# EAGLE schematic mainboard_2l (EAGLE 9.5.1)
c't-Bot Hauptplatine v2; CC BY-SA 4.0, Timo Sandmann

## Sheet 1 of 2
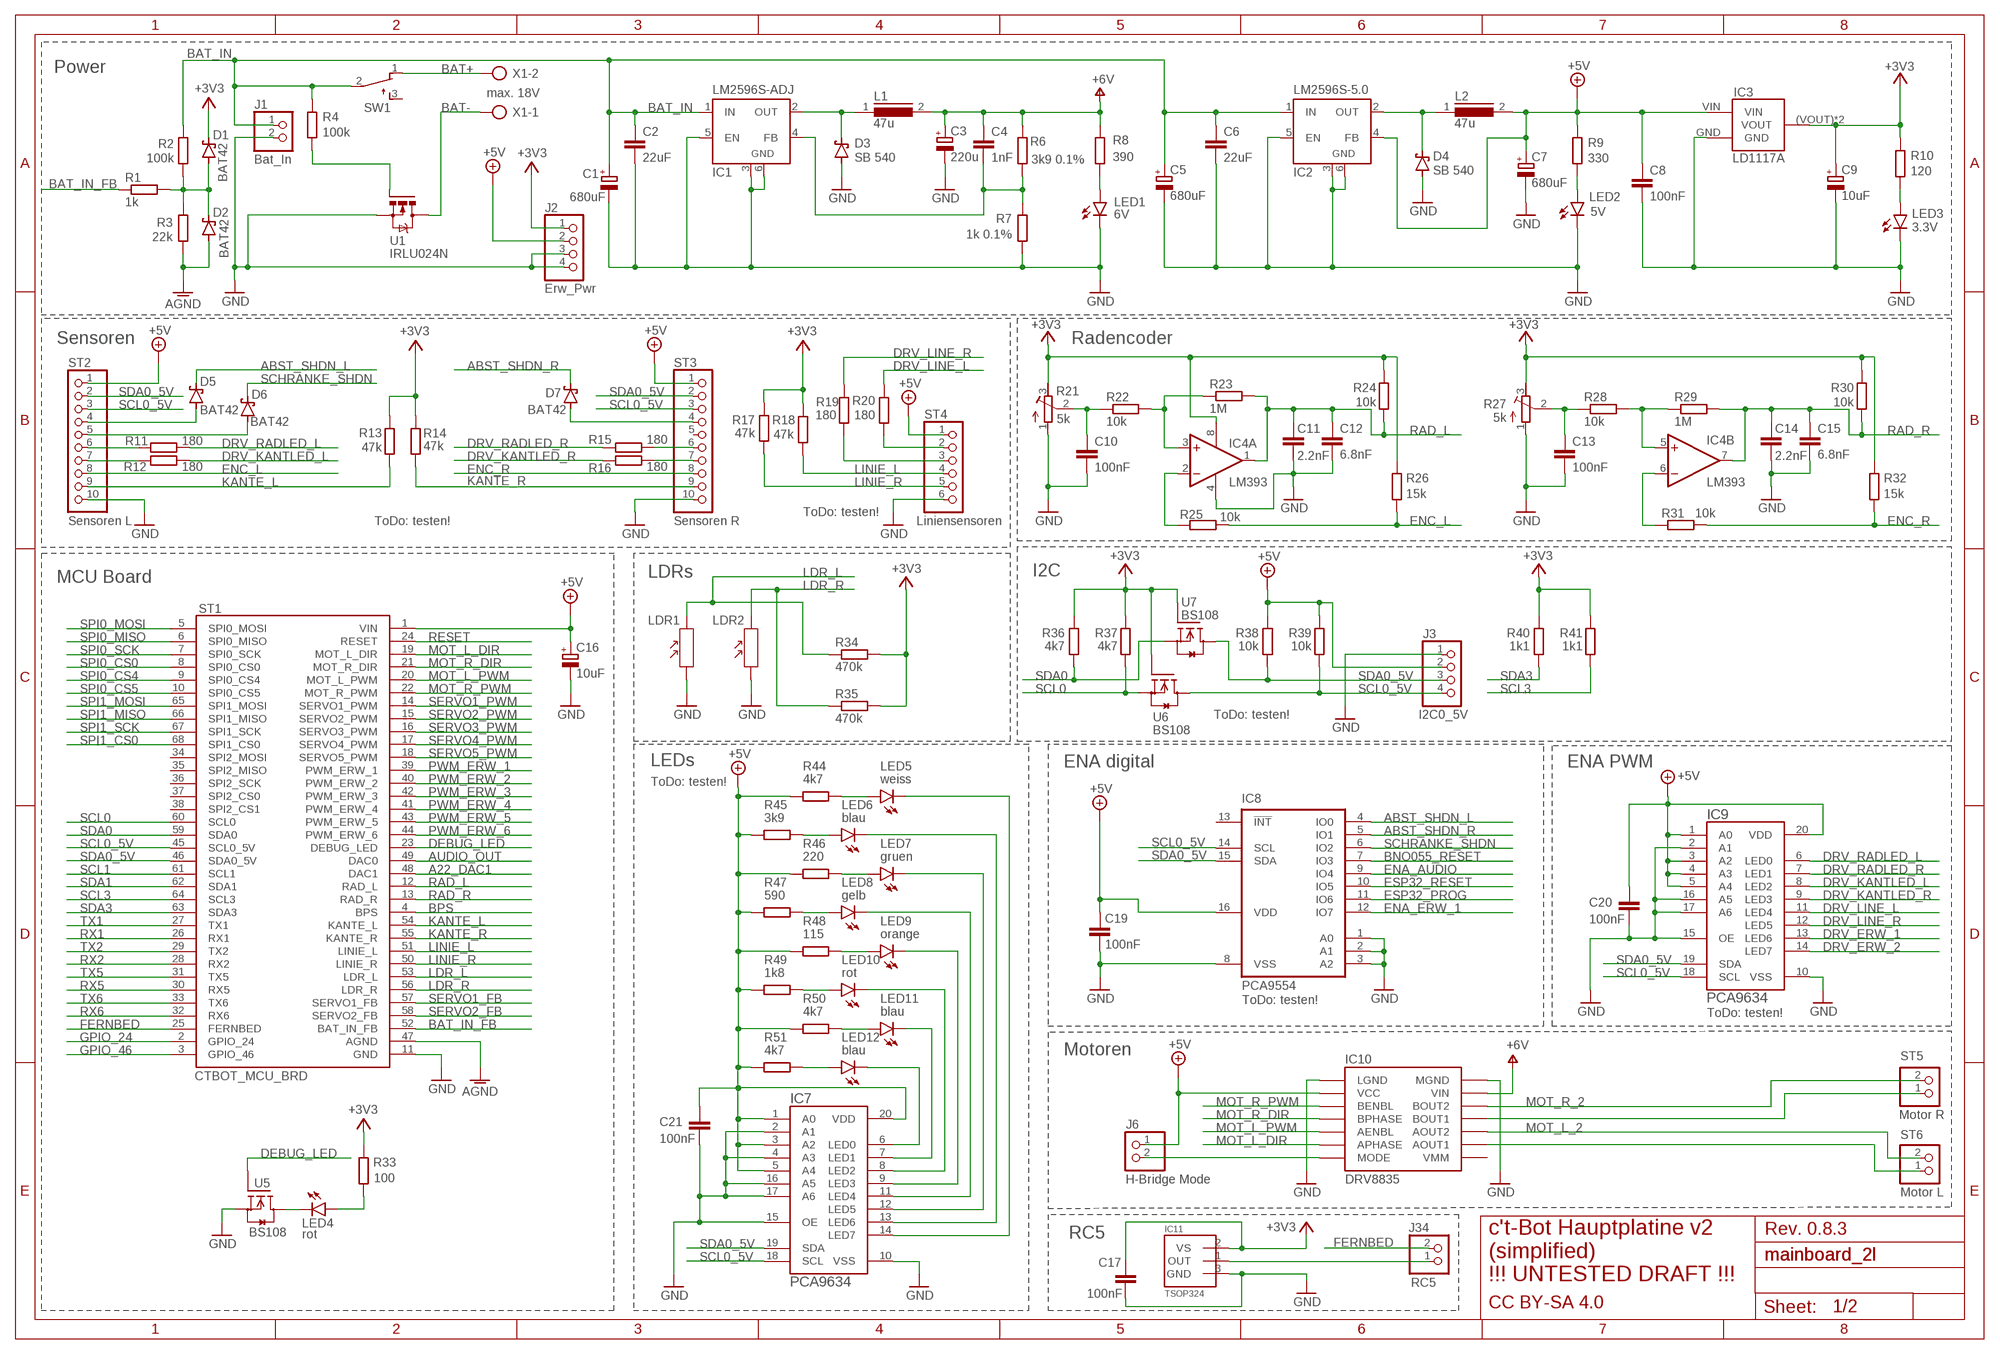
[diagram p0: schematic, sheet 1]

### Parts
C1  680uF  CPOL-EUE5-10.5  [E5-10,5]
C2  22uF  C-EU025-025X050  [C025-025X050]
C3  220u  CPOL-EUE5-10.5  [E5-10,5]
C4  1nF  C-EU025-025X050  [C025-025X050]
C5  680uF  CPOL-EUE5-10.5  [E5-10,5]
C6  22uF  C-EU025-025X050  [C025-025X050]
C7  680uF  CPOL-EUE5-10.5  [E5-10,5]
C8  100nF  C-EU025-025X050  [C025-025X050]
C9  10uF  CPOL-EUE2-5  [E2-5]
C10  100nF  C-EU025-025X050  [C025-025X050]
C11  2.2nF  C-EU025-025X050  [C025-025X050]
C12  6.8nF  C-EU025-025X050  [C025-025X050]
C13  100nF  C-EU025-025X050  [C025-025X050]
C14  2.2nF  C-EU025-025X050  [C025-025X050]
C15  6.8nF  C-EU025-025X050  [C025-025X050]
C16  10uF  CPOL-EUTT2D5L  [TT2D5L]
C17  100nF  C-EU025-025X050  [C025-025X050]
C19  100nF  C-EU025-025X050  [C025-025X050]
C20  100nF  C-EU025-025X050  [C025-025X050]
C21  100nF  C-EU025-025X050  [C025-025X050]
D1  BAT42  BAT42DO35-7  [DO35-7]
D2  BAT42  BAT42DO35-7  [DO35-7]
D3  SB 540  SCHOTTKY-DIODEDO201T15  [DO201T15]
D4  SB 540  SCHOTTKY-DIODEDO201T15  [DO201T15]
D5  BAT42  BAT42"  [0207/2V]
D6  BAT42  BAT42"  [0207/2V]
D7  BAT42  BAT42"  [0207/2V]
IC1  LM2596S-ADJ  LM2596S  [TO263-5]
IC2  LM2596S-5.0  LM2596S  [TO263-5]
IC3  LD1117A  LD1117  [LD1117SOT-223]
IC4  LM393  LM393N  [DIL08]
IC7  PCA9634  PCA9634-SO20  [SO20W]
IC8  PCA9554  PCA9554D  [SO16W]
IC9  PCA9634  PCA9634-SO20  [SO20W]
IC10  DRV8835  DRV8835THROUGHHOLE  [DRV8835]
IC11  TSOP324  [TSOP324]
J1  Bat_In  PINHD-1X2  [1X02]
J2  Erw_Pwr  PINHD-1X4  [1X04]
J3  I2C0_5V  PINHD-1X4  [1X04]
J6  H-Bridge Mode  PINHD-1X2  [1X02]
J34  RC5  PINHD-1X2  [1X02]
L1  47u  INDUCTOR_09HCP  [09HCP]
L2  47u  INDUCTOR_09HCP  [09HCP]
LDR1  MPY54C569  [SNR2-3.0]
LDR2  MPY54C569  [SNR2-3.0]
LED1  6V  LED3MM  [LED3MM]
LED2  5V  LED3MM  [LED3MM]
LED3  3.3V  LED3MM  [LED3MM]
LED4  rot  LED3MM  [LED3MM]
LED5  weiss  LED3MM  [LED3MM]
LED6  blau  LED3MM  [LED3MM]
LED7  gruen  LED3MM  [LED3MM]
LED8  gelb  LED3MM  [LED3MM]
LED9  orange  LED3MM  [LED3MM]
LED10  rot  LED3MM  [LED3MM]
LED11  blau  LED3MM  [LED3MM]
LED12  blau  LED3MM  [LED3MM]
R1  1k  R-EU_0204/7  [0204/7]
R2  100k  R-EU_0204/2V  [0204V]
R3  22k  R-EU_0204/7  [0204/7]
R4  100k  R-EU_0204/2V  [0204V]
R6  3k9 0.1%  R-EU_0204/2V  [0204V]
R7  1k 0.1%  R-EU_0204/2V  [0204V]
R8  390  R-EU_0204/2V  [0204V]
R9  330  R-EU_0204/2V  [0204V]
R10  120  R-EU_0204/2V  [0204V]
R11  180  R-EU_0204/2V  [0204V]
R12  180  R-EU_0204/2V  [0204V]
R13  47k  R-EU_0204/2V  [0204V]
R14  47k  R-EU_0204/2V  [0204V]
R15  180  R-EU_0204/2V  [0204V]
R16  180  R-EU_0204/2V  [0204V]
R17  47k  R-EU_0204/2V  [0204V]
R18  47k  R-EU_0204/2V  [0204V]
R19  180  R-EU_0204/2V  [0204V]
R20  180  R-EU_0204/2V  [0204V]
R21  5k  R-TRIMM64W  [RTRIM64W]
R22  10k  R-EU_0204/2V  [0204V]
R23  1M  R-EU_0204/2V  [0204V]
R24  10k  R-EU_0204/2V  [0204V]
R25  10k  R-EU_0204/2V  [0204V]
R26  15k  R-EU_0204/2V  [0204V]
R27  5k  R-TRIMM64W  [RTRIM64W]
R28  10k  R-EU_0204/7  [0204/7]
R29  1M  R-EU_0204/7  [0204/7]
R30  10k  R-EU_0204/7  [0204/7]
R31  10k  R-EU_0204/2V  [0204V]
R32  15k  R-EU_0204/2V  [0204V]
R33  100  R-EU_0204/2V  [0204V]
R34  470k  R-EU_0204/2V  [0204V]
R35  470k  R-EU_0204/2V  [0204V]
R36  4k7  R-EU_0204/2V  [0204V]
R37  4k7  R-EU_0204/2V  [0204V]
R38  10k  R-EU_0204/2V  [0204V]
R39  10k  R-EU_0204/2V  [0204V]
R40  1k1  R-EU_0204/2V  [0204V]
R41  1k1  R-EU_0204/2V  [0204V]
R44  4k7  R-EU_0204/2V  [0204V]
R45  3k9  R-EU_0204/2V  [0204V]
R46  220  R-EU_0204/2V  [0204V]
R47  590  R-EU_0204/2V  [0204V]
R48  115  R-EU_0204/2V  [0204V]
R49  1k8  R-EU_0204/2V  [0204V]
R50  4k7  R-EU_0204/2V  [0204V]
R51  4k7  R-EU_0204/2V  [0204V]
ST1  CTBOT_MCU_BRD  [DIP66]
ST2  Sensoren L  PS25-10PS25-10  [TS_PS25_10]
ST3  Sensoren R  PS25-10PS25-10  [TS_PS25_10]
ST4  Liniensensoren  PS25-6  [TS_PS25_6]
ST5  Motor R  PINHD90-1X2/90  [1X02/90]
ST6  Motor L  PINHD90-1X2/90  [1X02/90]
SW1  TL32PO  [TL3XPO]
U1  IRLU024N  IRLU024NTO-251AA  [TO251AA]
U5  BS108  [SOT54E]
U6  BS108  [SOT54E]
U7  BS108  [SOT54E]
X1  max. 18V  SCHRAUBKLEMME/2  [AK500/2-H]

### Nets
+3V3 [power]: C9.+ C17.1 D1.C IC3.(VOUT)(VOUT) IC3.VOUT IC4.8(P:V+) IC11.2(VS) J2.1 R10.2 R13.2 R14.1 R17.2 R18.2 R21.3(E) R24.2 R26.2 R27.3(E) R30.2 R32.2 R33.2 R34.2 R35.2 R36.2 R37.2 R40.2 R41.2 U6.G U7.G ; also sheet 2
+6V [high_current]: C3.+ C4.1 IC10.VIN L1.2 R6.2 R8.1 ; also sheet 2
A22_DAC1: ST1.48(DAC1) ; also sheet 2
ABST_SHDN_L: D5.2(C) IC8.4(IO0)
ABST_SHDN_R: D7.2(C) IC8.5(IO1)
AGND [power]: D2.A R3.1 ST1.47(AGND) ; also sheet 2
AUDIO_OUT: ST1.49(DAC0) ; also sheet 2
BAT+ [high_current]: SW1.1(O) X1.2
BAT- [high_current]: U1.2(D) U1.4(D) X1.1
BAT_IN [high_current]: C1.+ C2.1 C5.+ C6.1 IC1.1(IN) IC2.1(IN) J1.1 R2.2 R4.2 SW1.2(P)
BAT_IN_FB: R1.1 ST1.52(BAT_IN_FB)
BNO055_RESET: IC8.7(IO3) ; also sheet 2
BPS: ST1.4(BPS) ; also sheet 2
DEBUG_LED: ST1.23(DEBUG_LED) U5.G
DRV_ERW_1: IC9.13(LED6) ; also sheet 2
DRV_ERW_2: IC9.14(LED7) ; also sheet 2
DRV_KANTLED_L: IC9.8(LED2) R12.2
DRV_KANTLED_R: IC9.9(LED3) R16.1
DRV_LINE_L: IC9.11(LED4) R20.2
DRV_LINE_R: IC9.12(LED5) R19.2
DRV_RADLED_L: IC9.6(LED0) R11.2
DRV_RADLED_R: IC9.7(LED1) R15.1
ENA_AUDIO: IC8.9(IO4) ; also sheet 2
ENA_ERW_1: IC8.12(IO7) ; also sheet 2
ENC_L: R25.2 R26.1 ST2.8
ENC_R: R31.2 R32.1 ST3.8
ESP32_PROG: IC8.11(IO6) ; also sheet 2
ESP32_RESET: IC8.10(IO5) ; also sheet 2
FERNBED: J34.2 ST1.25(FERNBED)
GND [power]: C1.- C2.2 C3.- C5.- C6.2 C7.- C8.2 C9.- C10.2 C11.2 C12.2 C13.2 C14.2 C15.2 C16.- C17.2 C19.2 C20.2 C21.2 D3.A D4.A IC1.3(GND) IC1.5(EN) IC1.6(GND) IC2.3(GND) IC2.5(EN) IC2.6(GND) IC3.GND IC4.4(P:V-) IC7.2(A1) IC7.4(A3) IC7.10(VSS) IC7.15(OE) IC7.16(A5) IC7.17(A6) IC8.1(A0) IC8.2(A1) IC8.3(A2) IC8.8(VSS) IC9.2(A1) IC9.10(VSS) IC9.15(OE) IC9.16(A5) IC9.17(A6) IC10.LGND IC10.MGND IC11.3(GND) J1.2 J2.3 J2.4 J3.1 LDR1.1 LDR2.1 LED1.K(C) LED2.K(C) LED3.K(C) R7.1 R21.1(A) R27.1(A) ST1.11(GND) ST2.10 ST3.10 ST4.6 U1.3(S) U5.S ; also sheet 2
GPIO_24: ST1.2(GPIO_24) ; also sheet 2
GPIO_46: ST1.3(GPIO_46) ; also sheet 2
KANTE_L: R13.1 ST1.54(KANTE_L) ST2.9
KANTE_R: R14.2 ST1.55(KANTE_R) ST3.9
LDR_L: LDR1.2 R34.1 ST1.53(LDR_L)
LDR_R: LDR2.2 R35.1 ST1.56(LDR_R)
LINIE_L: R18.1 ST1.51(LINIE_L) ST4.4
LINIE_R: R17.1 ST1.50(LINIE_R) ST4.5
MOT_L_1 [high_current]: IC10.AOUT1 ST6.1
MOT_L_2: IC10.AOUT2 ST6.2
MOT_L_DIR: IC10.APHASE ST1.19(MOT_L_DIR)
MOT_L_PWM: IC10.AENBL ST1.20(MOT_L_PWM)
MOT_R_1 [high_current]: IC10.BOUT1 ST5.1
MOT_R_2: IC10.BOUT2 ST5.2
MOT_R_DIR: IC10.BPHASE ST1.21(MOT_R_DIR)
MOT_R_PWM: IC10.BENBL ST1.22(MOT_R_PWM)
N$1: R19.1 ST4.3
N$2: LED3.A R10.1
N$3: IC10.MODE J6.2
N$4: D1.A D2.C R1.2 R2.1 R3.2
N$5: IC4.2(A:-IN) R25.1
N$6: IC7.6(LED0) LED12.K(C)
N$7: IC7.7(LED1) LED11.K(C)
N$8 [power]: LED1.A R8.2
N$9: C4.2 IC1.4(FB) R6.1 R7.2
N$10: IC4.6(B:-IN) R31.1
N$11: LED2.A R9.1
N$13: IC7.8(LED2) LED10.K(C)
N$15: IC7.9(LED3) LED9.K(C)
N$16: IC7.11(LED4) LED8.K(C)
N$17: IC7.12(LED5) LED7.K(C)
N$18: IC7.13(LED6) LED6.K(C)
N$19: IC7.14(LED7) LED5.K(C)
N$20: LED5.A R44.2
N$21: LED6.A R45.2
N$22: LED7.A R46.2
N$23: LED8.A R47.2
N$24: LED9.A R48.2
N$25: LED10.A R49.2
N$26: LED11.A R50.2
N$27: LED12.A R51.2
N$28: LED4.A R33.1
N$29: LED4.K(C) U5.D
N$30: R20.1 ST4.2
N$34: C10.1 R21.2(S) R22.1
N$35: IC4.3(A:+IN) R22.2 R23.1
N$36: C13.1 R27.2(S) R28.1
N$37: IC4.5(B:+IN) R28.2 R29.1
N$38: R4.1 U1.1(G)
N$45: R15.2 ST3.6
N$47: R11.1 ST2.6
N$51: R12.1 ST2.7
N$53: R16.2 ST3.7
PWM_ERW_1: ST1.39(PWM_ERW_1)
PWM_ERW_2: ST1.40(PWM_ERW_2)
PWM_ERW_3: ST1.42(PWM_ERW_3) ; also sheet 2
PWM_ERW_4: ST1.41(PWM_ERW_4)
PWM_ERW_5: ST1.43(PWM_ERW_5)
PWM_ERW_6: ST1.44(PWM_ERW_6)
RAD_L: C11.1 C12.1 IC4.1(A:OUT) R23.2 R24.1 ST1.12(RAD_L)
RAD_R: C14.1 C15.1 IC4.7(B:OUT) R29.2 R30.1 ST1.13(RAD_R)
RC5: IC11.1(OUT) J34.1
RESET: ST1.24(RESET) ; also sheet 2
RX1: ST1.26(RX1) ; also sheet 2
RX2: ST1.28(RX2)
RX5: ST1.30(RX5) ; also sheet 2
RX6: ST1.32(RX6) ; also sheet 2
SCHRANKE_SHDN: D6.2(C) IC8.6(IO2)
SCL0: R37.1 ST1.60(SCL0) U6.S ; also sheet 2
SCL0_5V: IC7.18(SCL) IC8.14(SCL) IC9.18(SCL) J3.4 R39.1 ST1.45(SCL0_5V) ST2.3 ST3.3 U6.D ; also sheet 2
SCL1: ST1.61(SCL1)
SCL3: R41.1 ST1.64(SCL3) ; also sheet 2
SDA0: R36.1 ST1.59(SDA0) U7.S ; also sheet 2
SDA0_5V: IC7.19(SDA) IC8.15(SDA) IC9.19(SDA) J3.3 R38.1 ST1.46(SDA0_5V) ST2.2 ST3.2 U7.D ; also sheet 2
SDA1: ST1.62(SDA1)
SDA3: R40.1 ST1.63(SDA3) ; also sheet 2
SERVO1_FB: ST1.57(SERVO1_FB) ; also sheet 2
SERVO1_PWM: ST1.14(SERVO1_PWM) ; also sheet 2
SERVO2_FB: ST1.58(SERVO2_FB)
SERVO2_PWM: ST1.15(SERVO2_PWM)
SERVO3_PWM: ST1.16(SERVO3_PWM)
SERVO4_PWM: ST1.17(SERVO4_PWM) ; also sheet 2
SERVO5_PWM: ST1.18(SERVO5_PWM) ; also sheet 2
SPI0_CS0: ST1.8(SPI0_CS0) ; also sheet 2
SPI0_CS4: ST1.9(SPI0_CS4) ; also sheet 2
SPI0_CS5: ST1.10(SPI0_CS5) ; also sheet 2
SPI0_MISO: ST1.6(SPI0_MISO) ; also sheet 2
SPI0_MOSI: ST1.5(SPI0_MOSI) ; also sheet 2
SPI0_SCK: ST1.7(SPI0_SCK) ; also sheet 2
SPI1_CS0: ST1.68(SPI1_CS0) ; also sheet 2
SPI1_MISO: ST1.66(SPI1_MISO) ; also sheet 2
SPI1_MOSI: ST1.65(SPI1_MOSI) ; also sheet 2
SPI1_SCK: ST1.67(SPI1_SCK) ; also sheet 2
TX1: ST1.27(TX1) ; also sheet 2
TX2: ST1.29(TX2)
TX5: ST1.31(TX5) ; also sheet 2
TX6: ST1.33(TX6) ; also sheet 2
V5_L1 [high_current]: D4.C IC2.2(OUT) L2.1
V6_L1 [high_current]: D3.C IC1.2(OUT) L1.1
VCC [power]: C7.+ C8.1 C16.+ C19.1 C20.1 C21.1 IC2.4(FB) IC3.VIN IC7.1(A0) IC7.3(A2) IC7.5(A4) IC7.20(VDD) IC8.16(VDD) IC9.1(A0) IC9.3(A2) IC9.4(A3) IC9.5(A4) IC9.20(VDD) IC10.VCC J2.2 J3.2 J6.1 L2.2 R9.2 R38.2 R39.2 R44.1 R45.1 R46.1 R47.1 R48.1 R49.1 R50.1 R51.1 ST1.1(VIN) ST2.1 ST3.1 ST4.1 ; supply symbol labelled +5V ; also sheet 2
VL53L0X_SHUT_L: D5.1(A) ST2.4
VL53L0X_SHUT_R: D7.1(A) ST3.4
VL6180X_SHDN: D6.1(A) ST2.5
Unconnected: IC8.13(!INT) IC10.VMM ST1.34(SPI2_MOSI) ST1.35(SPI2_MISO) ST1.36(SPI2_SCK) ST1.37(SPI2_CS0) ST1.38(SPI2_CS1) ST3.5 SW1.3(S)

### Notes on the sheet
- Power
- Sensoren | Radencoder
- ToDo: testen!
- ToDo: testen!
- LDRs | I2C
- MCU Board
- ToDo: testen!
- LEDs | ENA digital | ENA PWM
- ToDo: testen!
- ToDo: testen!
- ToDo: testen!
- Motoren
- RC5 | Rev. 0.8.3
- mainboard_2l
- c't-Bot Hauptplatine v2
  (simplified)
  !!! UNTESTED DRAFT !!!
- CC BY-SA 4.0

## Sheet 2 of 2
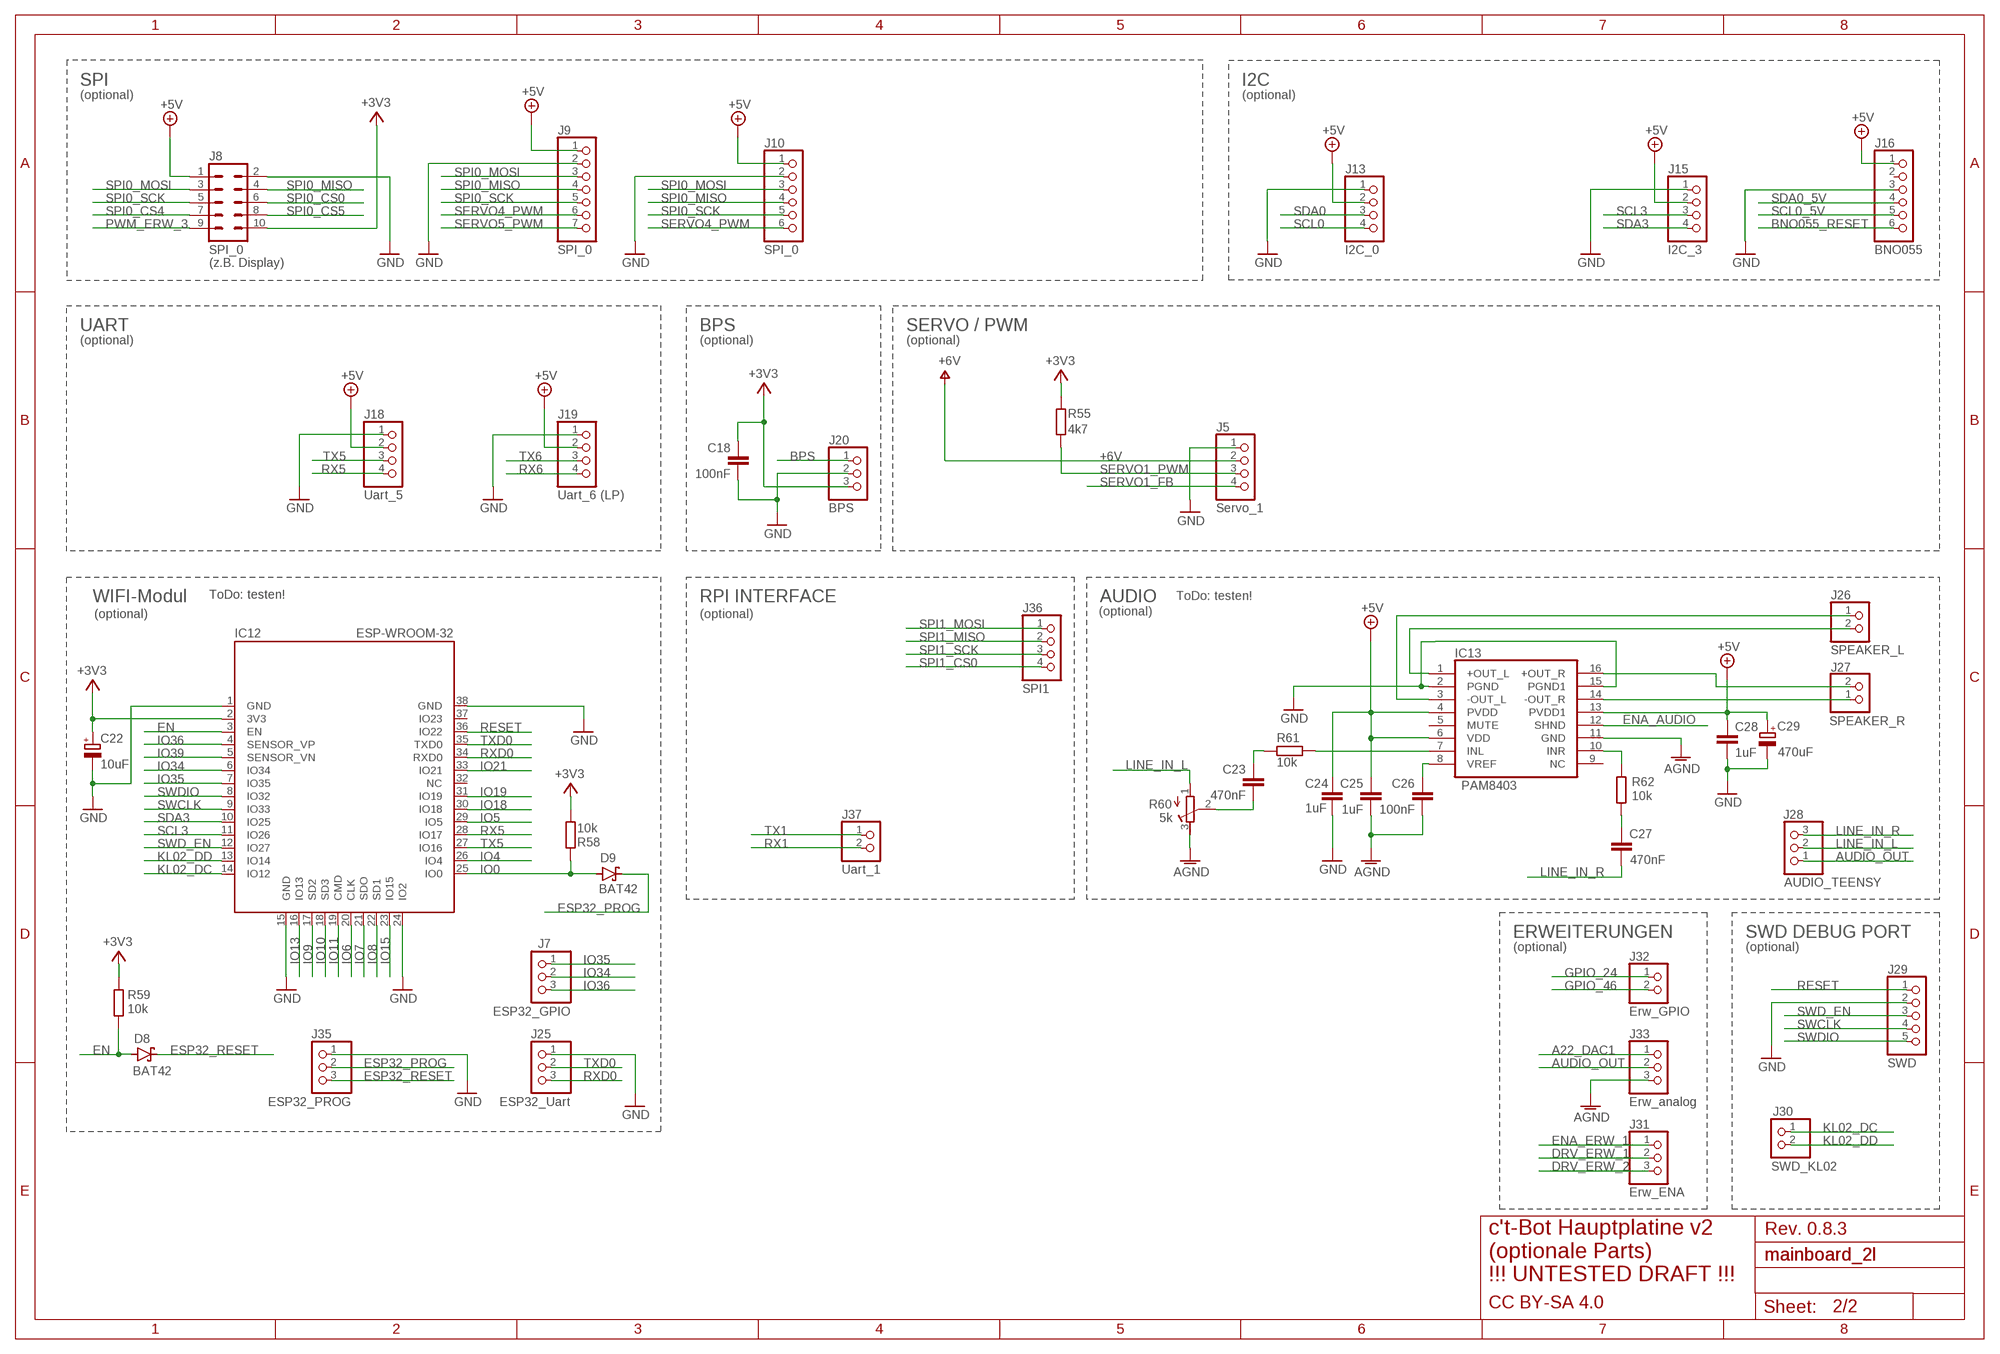
[diagram p1: schematic, sheet 2]

### Parts
C18  100nF  C-EU025-025X050  [C025-025X050]
C22  10uF  CPOL-EUE2.5-5  [E2,5-5]
C23  470nF  C-EU025-025X050  [C025-025X050]
C24  1uF  C-EU025-025X050  [C025-025X050]
C25  1uF  C-EU025-025X050  [C025-025X050]
C26  100nF  C-EU025-025X050  [C025-025X050]
C27  470nF  C-EU025-025X050  [C025-025X050]
C28  1uF  C-EU025-025X050  [C025-025X050]
C29  470uF  CPOL-EUE3.5-8  [E3,5-8]
D8  BAT42  BAT42"  [0207/2V]
D9  BAT42  BAT42"  [0207/2V]
IC12  ESP-WROOM-32  [ESP-WROOM-32]
IC13  PAM8403  [SOP-16]
J5  Servo_1  PINHD-1X4  [1X04]
J7  ESP32_GPIO  PINHD-1X3  [1X03]
J8  SPI_0  ML10  [ML10]
J9  SPI_0  PINHD-1X7  [1X07]
J10  SPI_0  PINHD-1X6  [1X06]
J13  I2C_0  PINHD-1X4  [1X04]
J15  I2C_3  PINHD-1X4  [1X04]
J16  BNO055  PINHD-1X6  [1X06]
J18  Uart_5  PINHD-1X4  [1X04]
J19  Uart_6 (LP)  PINHD-1X4  [1X04]
J20  BPS  PINHD-1X3  [1X03]
J25  ESP32_Uart  PINHD-1X3  [1X03]
J26  SPEAKER_L  PINHD-1X2  [1X02]
J27  SPEAKER_R  PINHD-1X2  [1X02]
J28  AUDIO_TEENSY  PINHD-1X3  [1X03]
J29  SWD  PINHD-1X5  [1X05]
J30  SWD_KL02  PINHD-1X2  [1X02]
J31  Erw_ENA  PINHD-1X3  [1X03]
J32  Erw_GPIO  PINHD-1X2  [1X02]
J33  Erw_analog  PINHD-1X3  [1X03]
J35  ESP32_PROG  PINHD-1X3  [1X03]
J36  SPI1  PINHD-1X4  [1X04]
J37  Uart_1  PINHD-1X2  [1X02]
R55  4k7  R-EU_0204/7  [0204/7]
R58  10k  R-EU_0204/2V  [0204V]
R59  10k  R-EU_0204/2V  [0204V]
R60  5k  R-TRIMM64W  [RTRIM64W]
R61  10k  R-EU_0204/2V  [0204V]
R62  10k  R-EU_0204/2V  [0204V]

### Nets
+3V3 [power]: C18.1 C22.+ IC12.2(3V3) J8.10 J20.3 R55.2 R58.1 R59.2 ; also sheet 1
+6V [high_current]: J5.2 ; also sheet 1
A22_DAC1: J33.1 ; also sheet 1
AGND [power]: C25.2 C26.2 IC13.11(GND) J33.3 R60.3(E) ; also sheet 1
AUDIO_OUT: J28.1 J33.2 ; also sheet 1
BNO055_RESET: J16.6 ; also sheet 1
BPS: J20.1 ; also sheet 1
DRV_ERW_1: J31.2 ; also sheet 1
DRV_ERW_2: J31.3 ; also sheet 1
EN: D8.1(A) IC12.3(EN) R59.1
ENA_AUDIO: IC13.12(SHND) ; also sheet 1
ENA_ERW_1: J31.1 ; also sheet 1
ESP32_PROG: D9.2(C) J35.2 ; also sheet 1
ESP32_RESET: D8.2(C) J35.3 ; also sheet 1
GND [power]: C18.2 C22.- C24.2 C28.2 C29.- IC12.1(GND) IC12.15(GND) IC12.24(IO2) IC12.38(GND) IC13.2(PGND) IC13.15(PGND1) J5.1 J8.2 J9.2 J10.2 J13.1 J15.1 J16.3 J18.1 J19.1 J20.2 J25.1 J29.2 J35.1 ; also sheet 1
GPIO_24: J32.1 ; also sheet 1
GPIO_46: J32.2 ; also sheet 1
IO0: D9.1(A) IC12.25(IO0) R58.2
IO4: IC12.26(IO4)
IO5: IC12.29(IO5)
IO6: IC12.20(CLK)
IO7: IC12.21(SDO)
IO8: IC12.22(SD1)
IO9: IC12.17(SD2)
IO10: IC12.18(SD3)
IO11: IC12.19(CMD)
IO13: IC12.16(IO13)
IO15: IC12.23(IO15)
IO18: IC12.30(IO18)
IO19: IC12.31(IO19)
IO21: IC12.33(IO21)
IO34: IC12.6(IO34) J7.2
IO35: IC12.7(IO35) J7.1
IO36: IC12.4(SENSOR_VP) J7.3
IO39: IC12.5(SENSOR_VN)
KL02_DC: IC12.14(IO12) J30.1
KL02_DD: IC12.13(IO14) J30.2
LINE_IN_L: J28.2 R60.1(A)
LINE_IN_R: C27.2 J28.3
N$31: IC13.1(+OUT_L) J26.2
N$32: IC13.3(-OUT_L) J26.1
N$33: C26.1 IC13.8(VREF)
N$40: IC13.7(INL) R61.1
N$41: C23.1 R61.2
N$42: C23.2 R60.2(S)
N$43: IC13.14(-OUT_R) J27.1
N$44: IC13.16(+OUT_R) J27.2
N$46: IC13.10(INR) R62.1
N$48: C27.1 R62.2
PWM_ERW_3: J8.9 ; also sheet 1
RESET: IC12.36(IO22) J29.1 ; also sheet 1
RX1: J37.2 ; also sheet 1
RX5: IC12.28(IO17) J18.4 ; also sheet 1
RX6: J19.4 ; also sheet 1
RXD0: IC12.34(RXD0) J25.3
SCL0: J13.4 ; also sheet 1
SCL0_5V: J16.5 ; also sheet 1
SCL3: IC12.11(IO26) J15.3 ; also sheet 1
SDA0: J13.3 ; also sheet 1
SDA0_5V: J16.4 ; also sheet 1
SDA3: IC12.10(IO25) J15.4 ; also sheet 1
SERVO1_FB: J5.4 ; also sheet 1
SERVO1_PWM: J5.3 R55.1 ; also sheet 1
SERVO4_PWM: J9.6 J10.6 ; also sheet 1
SERVO5_PWM: J9.7 ; also sheet 1
SPI0_CS0: J8.6 ; also sheet 1
SPI0_CS4: J8.7 ; also sheet 1
SPI0_CS5: J8.8 ; also sheet 1
SPI0_MISO: J8.4 J9.4 J10.4 ; also sheet 1
SPI0_MOSI: J8.3 J9.3 J10.3 ; also sheet 1
SPI0_SCK: J8.5 J9.5 J10.5 ; also sheet 1
SPI1_CS0: J36.4 ; also sheet 1
SPI1_MISO: J36.2 ; also sheet 1
SPI1_MOSI: J36.1 ; also sheet 1
SPI1_SCK: J36.3 ; also sheet 1
SWCLK: IC12.9(IO33) J29.4
SWD_EN: IC12.12(IO27) J29.3
SWDIO: IC12.8(IO32) J29.5
TX1: J37.1 ; also sheet 1
TX5: IC12.27(IO16) J18.3 ; also sheet 1
TX6: J19.3 ; also sheet 1
TXD0: IC12.35(TXD0) J25.2
VCC [power]: C24.1 C25.1 C28.1 C29.+ IC13.4(PVDD) IC13.6(VDD) IC13.13(PVDD1) J8.1 J9.1 J10.1 J13.2 J15.2 J16.1 J18.2 J19.2 ; supply symbol labelled +5V ; also sheet 1
Unconnected: IC12.32(NC) IC12.37(IO23) IC13.5(MUTE) IC13.9(NC) J16.2

### Notes on the sheet
- SPI | I2C
- (optional) | (optional)
- (z.B. Display)
- UART | BPS | SERVO / PWM
- (optional) | (optional) | (optional)
- ToDo: testen! | ToDo: testen!
- WIFI-Modul | RPI INTERFACE | AUDIO
- (optional) | (optional) | (optional)
- ERWEITERUNGEN | SWD DEBUG PORT
- (optional) | (optional)
- Rev. 0.8.3
- mainboard_2l
- c't-Bot Hauptplatine v2
  (optionale Parts)
  !!! UNTESTED DRAFT !!!
- CC BY-SA 4.0

## Library data of the parts
C1 C3 C5 C7 C9 C16 C22 C29 = rcl:CPOL-EU: POLARIZED CAPACITOR, European symbol; SPICEPREFIX: C
C2 C4 C6 C8 C10-C15 C17-C21 C23-C28 = rcl:C-EU: CAPACITOR, European symbol; SPICEPREFIX: C
D1 D2 D5-D9 = ct-bot:BAT42: DIODE barrier diode
D3 D4 = diode:SCHOTTKY-DIODE: Schottky Diode
IC1 IC2 = ct-bot:LM2596S: STEP-DOWN VOLTAGE REGULATOR
IC3 = ct-bot:LD1117
IC4 = linear:LM393: COMPARATOR; SPICEPREFIX: J
IC7 IC9 = ct-bot:PCA9634: NXP PCA9634 8-bit LED Controller
IC8 = ct-bot:PCA9554: I/O EXPANDER 8-bit I2C-bus and SMBus I/O port with interrupt
IC10 = ct-bot:DRV8835
IC11 = ct-bot:TSOP324*: IR Receiver Modules for Remote Control Systems http://www.vishay.com/ir-receiver-modules/
IC12 = ct-bot:ESP-WROOM-32
IC13 = ct-bot:PAM8403: Dual channel audio amplifier IC - PAM8403
J1 J6 J26 J27 J30 J32 J34 J37 = ct-bot:PINHD-1X2: PIN HEADER
J2 J3 J5 J13 J15 J18 J19 J36 = ct-bot:PINHD-1X4: PIN HEADER
J7 J25 = ct-bot:PINHD-1X3: PIN HEADER; SPICEPREFIX: J
J8 = con-harting-ml:ML10: HARTING; OC_FARNELL: unknown; OC_NEWARK: unknown
J9 = ct-bot:PINHD-1X7: PIN HEADER
J10 J16 = ct-bot:PINHD-1X6: PIN HEADER
J20 J28 J31 J33 J35 = ct-bot:PINHD-1X3: PIN HEADER
J29 = ct-bot:PINHD-1X5: PIN HEADER
L1 L2 = ct-bot:INDUCTOR_09HCP: INDUCTOR
LDR1 LDR2 = ct-bot:MPY54C569: 314020017; MPN: PHOTORESISTOR-5528-10K; VALUE: PHOTORESISTOR-5528-10K
LED1-LED12 = led:LED: LED OSRAM: - CHIPLED LG R971, LG N971, LY N971, LG Q971, LY Q971, LO R971, LY R971 LH N974, LH R974 LS Q976, LO Q976, LY Q976 LO Q996 - Hyper CHIPLED LW Q18S LB Q993, LB Q99A, LB R99A - SideLED LS A670, LO A670, LY A670, LG A670, LP A670 LB A673, LV A673, LT A673, LW A673 LH A674 LY A675 LS A676, LA A676, LO A676, LY A676, LW A676 LS A679, LY A679, LG A679 - Hyper Micro SIDELED® LS Y876, LA Y876, LO Y876, LY Y876 LT Y87S - SmartLED LW L88C, LW L88S LB L89C, LB L89S, LG L890 LS L89K, LO L89K, LY L89K LS L896, LA L896, LO L896, LY L896 - TOPLED LS T670, LO T670, LY T670, LG T670, LP T670 LSG T670, LSP T670, LSY T670, LOP T670, LYG T670 LG T671, LOG T671, LSG T671 LB T673, LV T673, LT T673, LW T673 LH T674 LS T676, LA T676, LO T676, LY T676, LB T676, LH T676, LSB T676, LW T676 LB T67C, LV T67C, LT T67C, LS T67K, LO T67K, LY T67K, LW E67C LS E67B, LA E67B, LO E67B, LY E67B, LB E67C, LV E67C, LT E67C LW T67C LS T679, LY T679, LG T679 LS T770, LO T770, LY T770, LG T770, LP T770 LB T773, LV T773, LT T773, LW T773 LH T774 LS E675, LA E675, LY E675, LS T675 LS T776, LA T776, LO T776, LY T776, LB T776 LHGB T686 LT T68C, LB T68C - Hyper Mini TOPLED® LB M676 - Mini TOPLED Santana® LG M470 LS M47K, LO M47K, LY M47K Source: http://www.osram.convergy.de LUXEON: - LUMILED® LXK2-PW12-R00, LXK2-PW12-S00, LXK2-PW14-U00, LXK2-PW14-V00 LXK2-PM12-R00, LXK2-PM12-S00, LXK2-PM14-U00 LXK2-PE12-Q00, LXK2-PE12-R00, LXK2-PE12-S00, LXK2-PE14-T00, LXK2-PE14-U00 LXK2-PB12-K00, LXK2-PB12-L00, LXK2-PB12-M00, LXK2-PB14-N00, LXK2-PB14-P00, LXK2-PB14-Q00 LXK2-PR12-L00, LXK2-PR12-M00, LXK2-PR14-Q00, LXK2-PR14-R00 LXK2-PD12-Q00, LXK2-PD12-R00, LXK2-PD12-S00 LXK2-PH12-R00, LXK2-PH12-S00 LXK2-PL12-P00, LXK2-PL12-Q00, LXK2-PL12-R00 Source: www.luxeon.com KINGBRIGHT: KA-3528ASYC Source: www.kingbright.com
R1-R4 R6-R20 R22-R26 R28-R41 R44-R51 R55 R58 R59 R61 R62 = rcl:R-EU_: RESISTOR, European symbol; SPICEPREFIX: R
R21 R27 R60 = ct-bot:R-TRIMM: Trimm resistor; SPICEMODEL: X; SPICEPREFIXL: POT
ST1 = ct-bot:CTBOT_MCU_BRD
ST2 ST3 = ct-bot:PS25-10: PIN HEADER
ST4 = ct-bot:PS25-6: PIN-HEADER
ST5 ST6 = ct-bot:PINHD90-1X2: PIN HEADER
SW1 = switch:TL32PO: TINY SWITCH ON - MOM Source: http://www2.produktinfo.conrad.com/datenblaetter/700000-724999/705152-da-01-de-Subminiaturschalter_TL_36YO.pdf
U1 = ct-bot:IRLU024N: N-CHANNEL MOS FET IRLU 024N
U5-U7 = ct-bot:BS108: N-CHANNEL MOS FET
X1 = ct-bot:SCHRAUBKLEMME/2; OC_FARNELL: unknown; OC_NEWARK: unknown

## Net classes
0 default: width 0.203 mm, drill 0.33 mm, clearance 0.203 mm
1 power: width 0.305 mm, drill 0.33 mm, clearance 0.203 mm to class 0, clearance 0.203 mm
2 high_current: width 0.305 mm, drill 0.33 mm, clearance 0.203 mm to class 0, clearance 0.203 mm to class 1, clearance 0.203 mm